# Altium schematic sheet Bee Hive MasterBoard.SchDoc
size A3
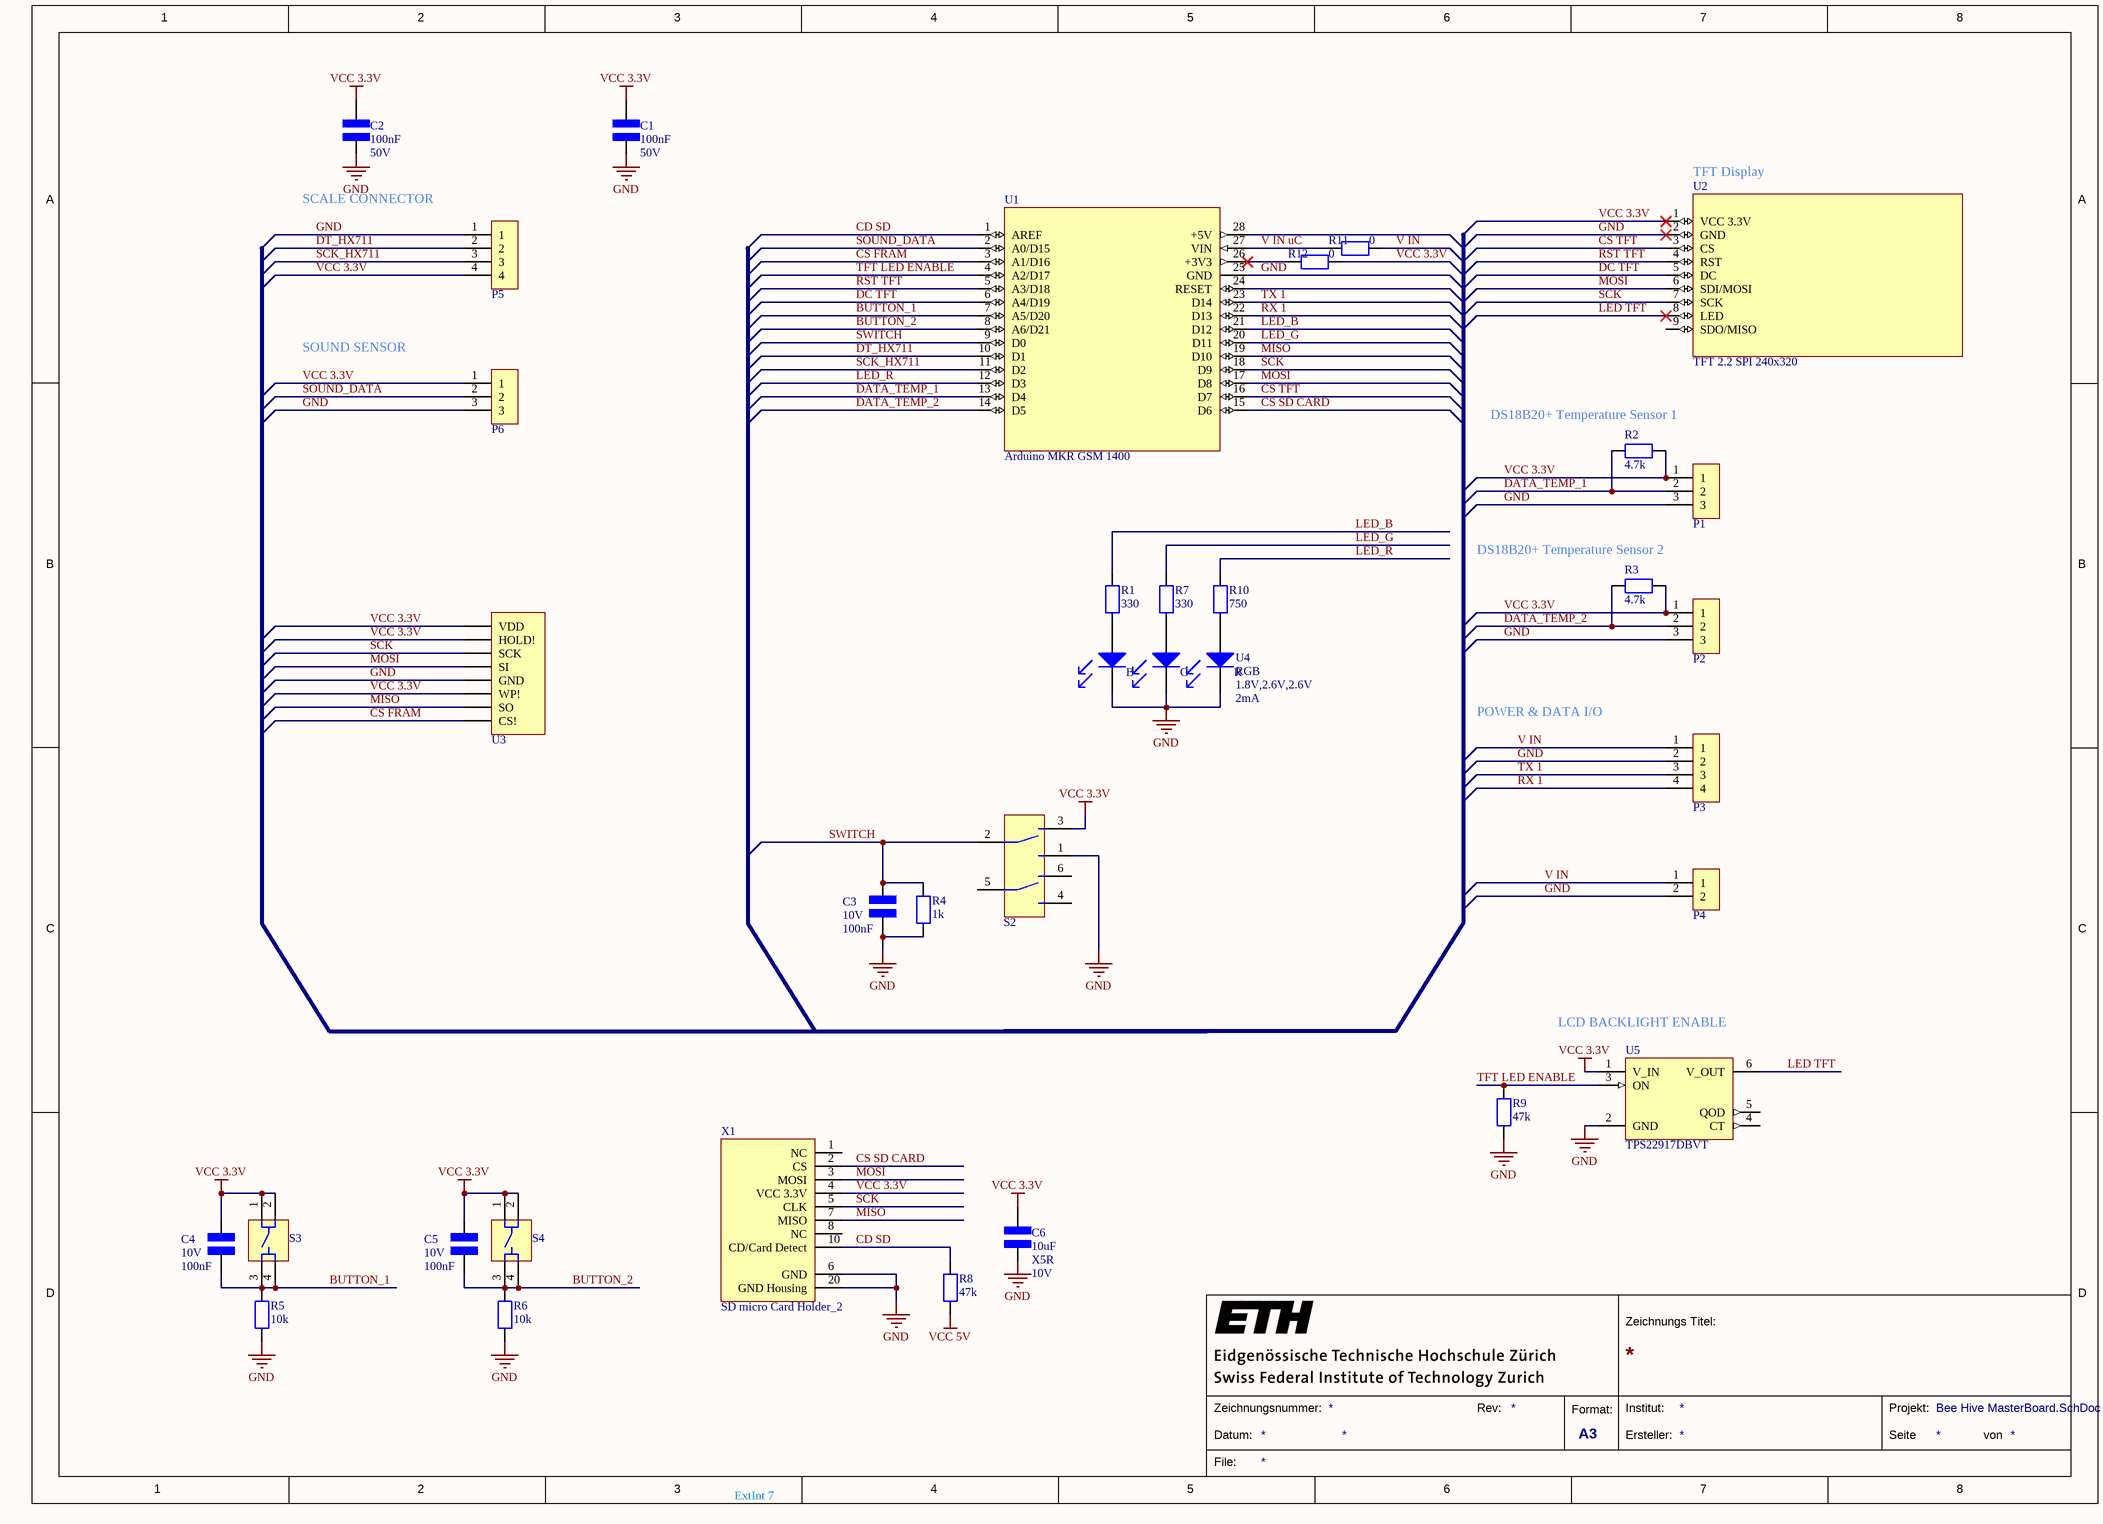
[diagram p0: Bee Hive MasterBoard.SchDoc]

## Parts
C1  value 100nF  Umax: 50V  [CAP 0603]  (hidden comment: 100nF 0603_1)
C2  value 100nF  Umax: 50V  [CAP 0603]  (hidden comment: 100nF 0603_1)
C3  value 100nF  Umax: 10V  [CAP 0603]  (hidden comment: 100nF 0603)
C4  value 100nF  Umax: 10V  [CAP 0603]  (hidden comment: 100nF 0603)
C5  value 100nF  Umax: 10V  [CAP 0603]  (hidden comment: 100nF 0603)
C6  value 10uF  Dielektrikum: X5R  Umax: 10V  [CAP 0603]  (hidden comment: 10uF 0603)
P1  3-Pin Right Angle Housing  [3PIN - RND 205-EK254-2.54-03P]  (value not drawn)
P2  3-Pin Right Angle Housing  [3PIN - RND 205-EK254-2.54-03P]  (value not drawn)
P3  4-Pin Right Angle Housing  [4PIN - RND 205-EK254-2.54-04P]  (value not drawn)
P4  2-Pin Right Angle Housing  [2PIN - RND 205-EK254-2.54-02P]  (value not drawn)
P5  4-Pin Right Angle Housing  [4PIN - RND 205-EK254-2.54-04P]  (value not drawn)
P6  3-Pin Right Angle Housing  [3PIN - RND 205-EK254-2.54-03P]  (value not drawn)
R1  value 330  [RES 0603 FOOTPRINT]  (hidden comment: 330 Ohm 0603)
R2  value 4.7k  [RES 0603 FOOTPRINT]  (hidden comment: 4.7k Ohm 0603)
R3  value 4.7k  [RES 0603 FOOTPRINT]  (hidden comment: 4.7k Ohm 0603)
R4  value 1k  [RES 0603 FOOTPRINT]  (hidden comment: 1k Ohm 0603)
R5  value 10k  [RES 0603 FOOTPRINT]  (hidden comment: 10k Ohm 0603)
R6  value 10k  [RES 0603 FOOTPRINT]  (hidden comment: 10k Ohm 0603)
R7  value 330  [RES 0603 FOOTPRINT]  (hidden comment: 330 Ohm 0603)
R8  value 47k  [RES 0603 FOOTPRINT]  (hidden comment: 47k Ohm 0603)
R9  value 47k  [RES 0603 FOOTPRINT]  (hidden comment: 47k Ohm 0603)
R10  value 750  [RES 0603 FOOTPRINT]  (hidden comment: 750 Ohm 0603)
R11  value 0  [RES 0603 FOOTPRINT]  (hidden comment: 0 Ohm 0603)
R12  value 0  [RES 0603 FOOTPRINT]  (hidden comment: 0 Ohm 0603)
S2  Schiebeschalter EG2207  [Schiebeschalter on-on 2 P, EG2207]  (value not drawn)
S3  Taster Print_SMD_3  [Taster Print - SMD - PTS647SM70SMTR2LFS]  (value not drawn)
S4  Taster Print_SMD_3  [Taster Print - SMD - PTS647SM70SMTR2LFS]  (value not drawn)
U1  Arduino MKR GSM 1400  [Arduino GSM MKR 1400 v2]
U2  TFT 2.2 SPI 240x320  [TFT 2.2 SPI 240x320]
U3  FRAM MB85RS256BPNF-G-JNERE1  [SO 8Pin]  (value not drawn)
U4  COLOR: RGB  Forward Voltage: 1.8V,2.6V,2.6V  If: 2mA  [LED SMD 3529 - 3.5 X 2.8MM]  (hidden comment: LED Diode SMD LOW CURRENT)
U5  TPS22917DBVT  [SOT23 - 6]
X1  SD micro Card Holder_2  [SD Card Holder - micro - 2 - sd Card inserted]

## Nets
GND: C1.1 C2.1 C3.2 C6.1 P1.3 P2.3 P3.2 P4.2 P5.1 P6.3 R4.1 R5.1 R6.1 R9.1 S2.1 U1.25(GND) U2.2(GND) U3.4(GND) U4.1(K) U4.2(K) U4.3(K) U5.2(GND) X1.6(GND) X1.20(GND_Housing)
VCC 3.3V: C1.2 C2.2 C4.1 C5.1 C6.2 P1.1 P2.1 P5.4 P6.1 R2.1 R3.1 R12.2 S2.3 S3.1 S3.2 S4.1 S4.2 U2.1(VCC_3.3V) U3.3(WP!) U3.7(HOLD!) U3.8(VDD) U5.1(V_IN) X1.4(VCC_3.3V)
VCC 5V: R8.2
BUTTON_1: C4.2 R5.2 S3.3 S3.4 U1.7(A5/D20)
BUTTON_2: C5.2 R6.2 S4.3 S4.4 U1.8(A6/D21)
CD SD: R8.1 U1.1(AREF) X1.10(CD/Card_Detect)
CS FRAM: U1.3(A1/D16) U3.1(CS!)
CS SD CARD: U1.15(D6) X1.2(CS)
CS TFT: U1.16(D7) U2.3(CS)
DATA_TEMP_1: P1.2 R2.2 U1.13(D4)
DATA_TEMP_2: P2.2 R3.2 U1.14(D5)
DC TFT: U1.6(A4/D19) U2.5(DC)
DT_HX711: P5.2 U1.10(D1)
LED TFT: U2.8(LED) U5.6(V_OUT)
LED_B: R1.2 U1.21(D12)
LED_G: R7.2 U1.20(D11)
LED_R: R10.2 U1.12(D3)
MISO: U1.19(D10) U3.2(SO) X1.7(MISO)
MOSI: U1.17(D8) U2.6(SDI/MOSI) U3.5(SI) X1.3(MOSI)
RST TFT: U1.5(A3/D18) U2.4(RST)
RX 1: P3.4 U1.22(D13)
SCK: U1.18(D9) U2.7(SCK) U3.6(SCK) X1.5(CLK)
SCK_HX711: P5.3 U1.11(D2)
SOUND_DATA: P6.2 U1.2(A0/D15)
SWITCH: C3.1 R4.2 S2.2 U1.9(D0)
TFT LED ENABLE: R9.2 U1.4(A2/D17) U5.3(ON)
TX 1: P3.3 U1.23(D14)
V IN: P3.1 P4.1 R11.2
V IN uC: R11.1 U1.27(VIN)
NetR1_1: R1.1 U4.4(A)
NetR7_1: R7.1 U4.5(A)
NetR10_1: R10.1 U4.6(A)
NetR12_1: R12.1 U1.26(+3V3)

Not connected (* = marked no-connect by the designer): S2 4 5 6; U1 24(RESET) 28(+5V); U2 9(SDO/MISO); U5 4(CT) 5(QOD); X1 1(NC) 8(NC)

## Notes on the sheet
- (near U2) TFT Display
- (near C2) SCALE CONNECTOR
- SOUND SENSOR
- (near R2) DS18B20+ Temperature Sensor 1
- (near R3) DS18B20+ Temperature Sensor 2
- POWER & DATA I/O
- (near U5) LCD BACKLIGHT ENABLE
- ExtInt 7
- 1
- 2
- 3
- 4
- 5
- 6
- 7
- 8
- A
- B
- C
- D
- Zeichnungs Titel:
- Datum:
- Zeichnungsnummer:
- Rev:
- Format:
- A3
- Ersteller:
- Institut:
- Seite
- Projekt:
- von
- File:
- (in symbol LED Diode SMD - RGB - 3.5x2.8mm- 2mA) B; G; R

## Library data of the parts
C1 C2 = 100nF 0603_1: C CERAMIC SMD; Bezeichnung: C SMD; Hersteller: Yageo; Hersteller Nr: CC0603JPX7R9BB104; Haendler: Mouser; Haendler Nr: 603-CC0603JPX79BB104; Preis (CHF): 0.15; housing/footprint: 0603
C3-C5 = 100nF 0603: C CERAMIC SMD; Bezeichnung: C SMD; Hersteller: Würth; Hersteller Nr: 885012206020; Haendler: Mouser; Haendler Nr: 710-885012206020; Preis (CHF): 0.05; housing/footprint: 0603
C6 = 10uF 0603: C CERAMIC SMD; Bezeichnung: C SMD; Hersteller: TDK; Hersteller Nr: C1608X5R1A106K080AC; Haendler: Mouser; Haendler Nr: 810-C1608X5R1A106K; Preis (CHF): 0.5; housing/footprint: 0603
P1 P2 P6 = 3-Pin Screw Terminal: 3-Pin; Preis (CHF): 0.60; Haendler: Distrelec; Haendler Nr: 301-27-919; ComponentLink1Description: Mouser; ComponentLink1URL: https://www.mouser.ch/ProductDetail/TE-Connectivity/640453-2?qs=sGAEpiMZZMs%252bGHln7q6pm5E1Eb6qwPl2KIU5TYv3tVY%3d
P3 P5 = 4-Pin Screw Terminal: 4-Pin; Preis (CHF): 0.60; Haendler: Distrelec; Hersteller: RND; Hersteller Nr: RND 205-EK254-2.54-04P; Haendler Nr: 301-27-920; ComponentLink1Description: Mouser; ComponentLink1URL: https://www.mouser.ch/ProductDetail/TE-Connectivity/640453-2?qs=sGAEpiMZZMs%252bGHln7q6pm5E1Eb6qwPl2KIU5TYv3tVY%3d
P4 = 2-Pin Screw Terminal: 2-Pin; Preis (CHF): 0.60; Haendler: Distrelec; Haendler Nr: 301-27-918; ComponentLink1Description: Mouser; ComponentLink1URL: https://www.mouser.ch/ProductDetail/TE-Connectivity/640453-2?qs=sGAEpiMZZMs%252bGHln7q6pm5E1Eb6qwPl2KIU5TYv3tVY%3d
R1 R7 = 330 Ohm 0603: R SMD; Haendler: Mouser; Haendler Nr: 603-RC0603FR-07330RL; Preis (CHF): 0.01; Bezeichnung: R SMD; housing/footprint: 0603
R2 R3 = 4.7k Ohm 0603: R SMD; Haendler: Mouser; Haendler Nr: 755-ESR03EZPF4701; Preis (CHF): 0.01; Bezeichnung: R SMD; housing/footprint: 0603
R4 = 1k Ohm 0603: R SMD; Hersteller Nr: CRCW06031K00FKEAC; Haendler: Mouser; Haendler Nr: 71-CRCW06031K00FKEAC; Preis (CHF): 0.01; Bezeichnung: R SMD; housing/footprint: 0603
R5 R6 = 10k Ohm 0603: R SMD; Hersteller: Yageo; Hersteller Nr: AC0603FR-0710KL; Haendler: Mouser; Haendler Nr: 603-AC0603FR-0710KL; Preis (CHF): 0.01; Bezeichnung: R SMD; housing/footprint: 0603
R8 R9 = 47k Ohm 0603: R SMD; Hersteller: Yageo; Hersteller Nr: AC0603FR-0747KL; Haendler: Mouser; Haendler Nr: 603-AC0603FR-0747KL; Preis (CHF): 0.01; Bezeichnung: R SMD; housing/footprint: 0603
R10 = 750 Ohm 0603: R SMD; Hersteller: Panasonic; Haendler: Mouser; Haendler Nr: 71-CRCW0603750RFKEAH; Preis (CHF): 0.0123; Haendler2: Farnell; Haendler2 Nr: 2059597; Bezeichnung: R SMD; housing/footprint: 0603
R11 R12 = 0 Ohm 0603: R SMD; Hersteller: ERJ-3GEY0R00V; Hersteller Nr: Panasonic; Haendler: Mouser; Haendler Nr: 667-ERJ-3GEY0R00V; Preis (CHF): 0.01; Bezeichnung: R SMD; housing/footprint: 0603
S2 = Schiebeschalter EG2207: Schiebeschalter on-on PCM12SMTR; Haendler: Mouser; Haendler Nr: 612-EG2207; Preis (CHF): 0.66; Hersteller: E SWITCH; Hersteller Nr: EG2207; ComponentLink1Description: C&K; ComponentLink1URL: https://www.ckswitches.com/products/switches/product-details/Slide/AYZ/AYZ0202AGRLC/
S3 S4 = Taster Print_SMD_6: Taster; Haendler Nr: 611-PTS647SM70SMTR2L; Haendler: Mouser; Preis (CHF): 0.38; Link: https://www.mouser.ch/ProductDetail/CK/PTS647SM70SMTR2LFS?qs=PqoDHHvF64%252Bxl5nIb9IaOw%3D%3D; ComponentLink1Description: link; ComponentLink1URL: https://www.digikey.ch/product-detail/de/wurth-electronics-inc/430473035826/732-7021-1-ND/5225469
U1 = Arduino MKR GSM 1400: https://store.arduino.cc/arduino-mkr-gsm-1400-1415; Preis (CHF): 75; Link: https://store.arduino.cc/arduino-mkr-gsm-1400-1415; ComponentLink3URL: http://ch.farnell.com/stmicroelectronics/stm32l496vgt6/mcu-arm-cortex-m4-80mhz-lqfp-100/dp/2725139?st=STM32L496VGT6
U2 = TFT 2.2 SPI 240x320: https://www.banggood.com/1_441_82_02_22_4-Inch-TFT-LCD-Display-Module-Colorful-Screen-Module-SPI-Interface-p-1494883.html?rmmds=search&ID=6211522&cur_warehouse=CN; Preis (CHF): 6; Haendler: Banggood / Aliexpress; Link: https://www.banggood.com/1_441_82_02_22_4-Inch-TFT-LCD-Display-Module-Colorful-Screen-Module-SPI-Interface-p-1494883.html?rmmds=search&ID=6211522&cur_warehouse=CN; ComponentLink3URL: http://ch.farnell.com/stmicroelectronics/stm32l496vgt6/mcu-arm-cortex-m4-80mhz-lqfp-100/dp/2725139?st=STM32L496VGT6; Link 2: https://de.aliexpress.com/item/4000839144387.html?spm=a2g0o.productlist.0.0.48ed5371jjv3wJ&algo_pvid=f087815a-197e-468a-8055-d99fc6734484&algo_expid=f087815a-197e-468a-8055-d99fc6734484-8&btsid=0ab50f6115912653966648062e4a8e&ws_ab_test=searchweb0_0,searchweb201602_,searchweb201603_
U3 = FRAM MB85RS256BPNF-G-JNERE1: Haendler: digikey; Haendler Nr: 865-1251-1-ND; Hersteller: FUJITSU; Preis (CHF): 3.9; Hersteller Nr.: MB85RS256BPNF-G-JNERE1; ComponentLink1Description: Product search; ComponentLink1URL: https://www.digikey.com/products/en?t=774&v=865&pv149=380462&pv961=349252&pv570=349254&pv142=158003
U4 = LED Diode SMD - RGB - 3.5x2.8mm- 2mA: AAAF3529LSEEZGKQBKS; Haendler: Mouser; Haendler Nr: 604-AAAF3529LSEEZGKQ; Hersteller: Knightbright; Preis (CHF): 1.31; Link: https://www.mouser.ch/ProductDetail/Kingbright/AAAF3529LSEEZGKQBKS/?qs=sGAEpiMZZMuCm2JlHBGefuS2vX%252blrKJR%252bqWFjFLEvKH8cDHFfJ9xOQ%3d%3d; Hersteller Nr: AAAF3529LSEEZGKQBKS
U5 = TPS22917DBVT: High Side Switch; Hersteller: TI; Preis (CHF): 0.6; Haendler Nr: 595-TPS22917DBVT; Haendler: Mouser; Code_JEDEC: SOT 23-6; Hersteller Nr: TPS22917DBVT; Link: https://www.mouser.ch/ProductDetail/Texas-Instruments/TPS22917DBVT?qs=sGAEpiMZZMve4%2fbfQkoj%252bPJ2V24ZqG0%252bKgHGtqls2rU%3d
X1 = SD micro Card Holder_2: SD micro Card  Holder; Hersteller Nr: 502774-0891; Hersteller: Molex; Haendler2 Nr: 2064063; Haendler2: Farnell; Preis (CHF): 3.15; Haendler: Mouser; Haendler Nr: 538-502774-0891